# Altium schematic sheet DataDriven_sheet3_power_supply.SchDoc
size A3; SheetNumber: 3; SheetTotal: 4; SPICEModelCacheYQGNTXUW: <root> / <DocumentId>YQGNTXUW</DocumentId> / <CacheFrame Number="0"> / <Model Name="umk107bj105_a-t" Kind="CKT"> / <Text>* UMK107BJ105_A-T     SPICE MODEL  ( General Type ) / *-------------------------------------------------------------------------------------------------------- / * Model Generated by TAIYO YUDEN Corporation (http://www.ty-top.com) / * Version 1.0 / * TAIYO YUDEN Control No. 170508_130520 / * Copyright(c) 2012 TAIYO YUDEN CO.,LTD. All Rights Reserved. / *-------------------------------------------------------------------------------------------------------- / * / * Products Name : Multilayer Ceramic Capacitors / * / * Characteristics : / *     Capacitance : 1 uF , Rated Voltage : 50V , TCC : X5R / *     Case Size : 1.6 x 0.8 / 0.063 x 0.031 [mm/inch] , Thickness : 0.8 / 0.031 [mm/inch] / *     (Conditions: Temperature = 25 degC , DC Bias Current/Voltage = 0A / 0V) / * / * Frequency Range : 40Hz - 3GHz / * / * External Node Assignments : / * / *  1  o---| |---o  2 / * / *-------------------------------------------------------------------------------------------------------- / .SubCkt UMK107BJ105_A-T 1 2 / **************************** / C0 1 110 0.79929u / Cm 1 101 0.13681u / C1 101 102 0.26224u / Rc1 101 102 5.8806k / C2 102 103 0.057839u / Rc2 102 103 469.42 / C3 103 110 0.014568u / Rc3 103 110 14.853 / C2m 1 301 0.13283u / C21 301 302 1.2593u / Rc21 301 302 6.3079k / C22 302 303 1.1189u / Rc22 302 303 6.9405k / C23 303 304 1.1421u / Rc23 303 304 6.4848k / C24 304 305 0.36861u / Rc24 304 305 785 / C25 305 306 0.39327u / Rc25 305 306 637.41 / C26 306 307 0.27451u / Rc26 306 307 19.365 / C27 307 308 0.15295u / Rc27 307 308 23.239 / C28 308 309 0.17569u / Rc28 308 309 17.788 / C29 309 110 1420.6p / Rc29 309 110 1.9725 / Rp0 1 110 500Meg / L0 110 120 0.24088n / Lm 120 130 0.1369n / L1 120 121 0.1842n / RL1 121 130 0.29804 / L2 120 122 0.40657n / RL2 122 130 0.57395 / L3 120 123 0.85773n / RL3 123 130 0.82282 / CR 120 124 0.11463u / LR 124 125 0.25983n / RR 125 130 52.447m / CL 130 140 1.4637p / LL 130 140 0.23986n / RL 130 140 33.985 / Rs 140 2 6.8539m / **************************** / .ends UMK107BJ105_A-T</Text> / </Model> / </CacheFrame> / </root>
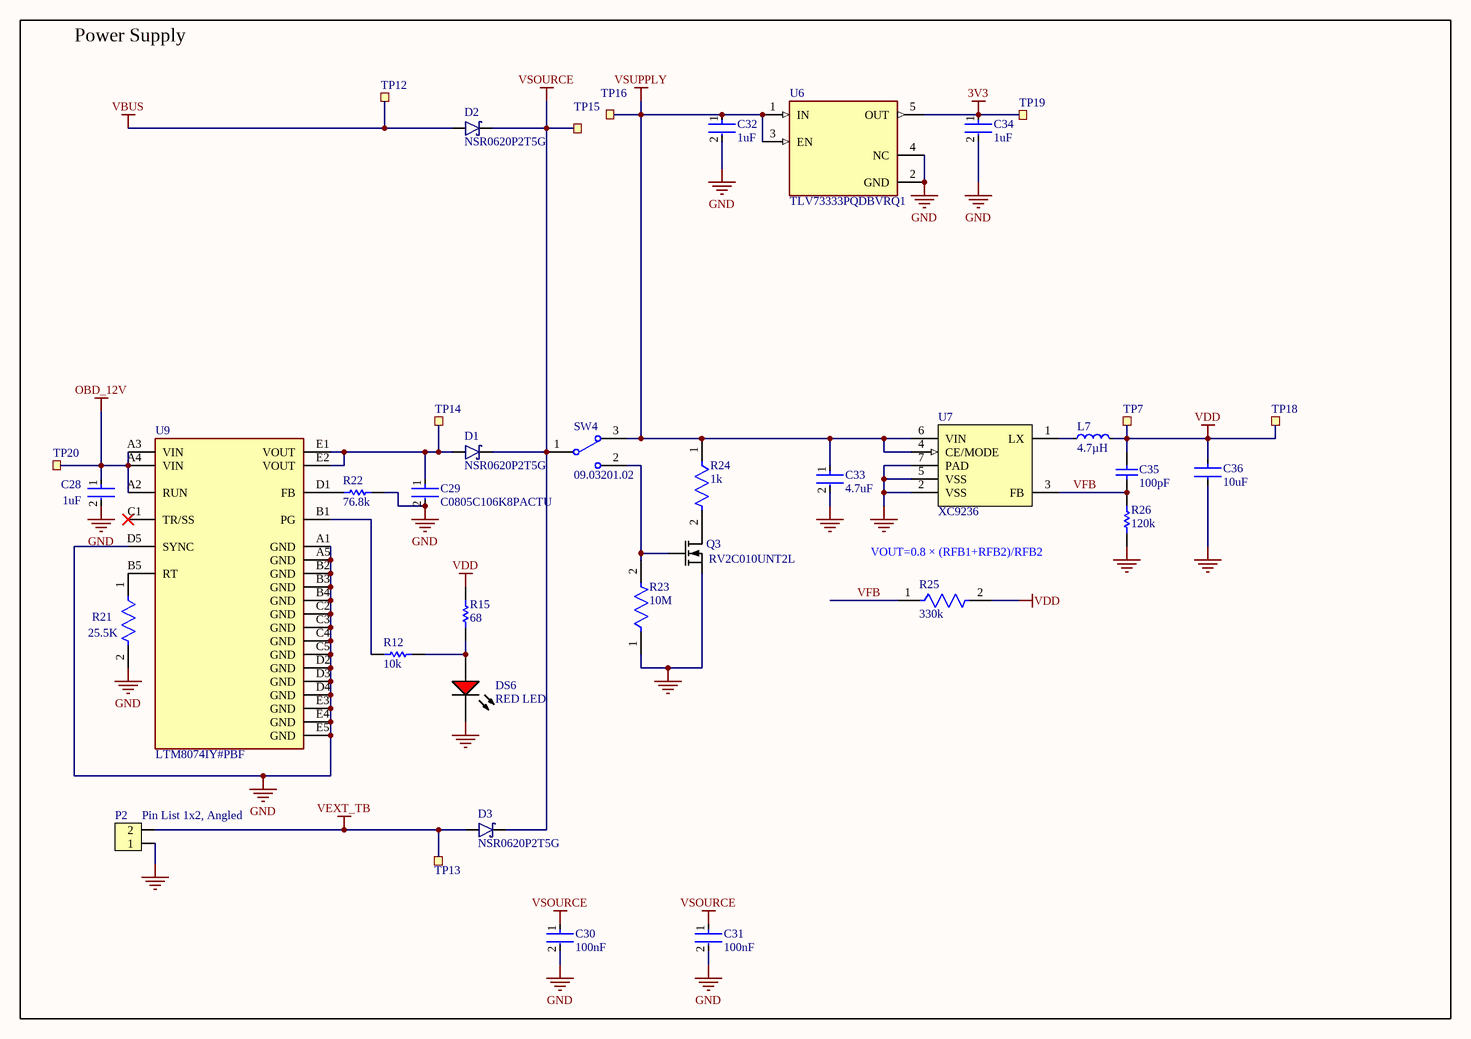
[diagram p0: DataDriven_sheet3_power_supply.SchDoc]

## Parts
C28  1uF  [FP-0603-L_1_6_0_1-W_0_8_0-IPC_A]
C29  C0805C106K8PACTU  [FP-C0805C-DG-MFG]
C30  100nF  [FP-CGA3E-0_3-0_1-IPC_A]
C31  100nF  [FP-CGA3E-0_3-0_1-IPC_A]
C32  1uF  [FP-GRT188-0_1-e0_2_0_5-IPC_B]
C33  4.7uF  [FP-GRM188-0_2-IPC_C]
C34  1uF  [FP-GRT188-0_1-e0_2_0_5-IPC_B]
C35  100pF  [CAPC1608X90X40ML10T20]
C36  10uF  [FP-CL10-IPC_C]
D1  NSR0620P2T5G  [SODFL100X40-2N]
D2  NSR0620P2T5G  [SODFL100X40-2N]
D3  NSR0620P2T5G  [SODFL100X40-2N]
DS6  RED LED  [VISH-TLMX1100_V]
L7  4.7µH  [TY-NR3015]
P2  Pin List 1x2, Angled  [LIST_ANG_1x2-SMD-2.54MM]
Q3  RV2C010UNT2L  [DFN65P100X40-3L]
R12  10k  [RESC1609X50X30NL8T20]
R15  68  [RESC1608X55X30ML15T15]
R21  25.5K  [FP-CRCW0603-e3-IPC_A]
R22  76.8k  [RESC1609X50X30ML10T20]
R23  10M  [FP-RMCF0603-IPC_A]
R24  1k  [FP-CRCW0603-e3-MFG]
R25  330k  [FP-CRCW0603-e3-IPC_A]
R26  120k  [RESC1609X55X30ML15T15]
SW4  09.03201.02  [EOZ-09.03201.02-3]
TP7  Ø1.5mm,SMD  [TP_SMD_D1.5mm]  (value not drawn)  (no BOM)
TP12  Ø1.5mm,SMD  [TP_SMD_D1.5mm]  (value not drawn)  (no BOM)
TP13  Ø1.5mm,SMD  [TP_SMD_D1.5mm]  (value not drawn)  (no BOM)
TP14  Ø1.5mm,SMD  [TP_SMD_D1.5mm]  (value not drawn)  (no BOM)
TP15  Ø1.5mm,SMD  [TP_SMD_D1.5mm]  (value not drawn)  (no BOM)
TP16  Ø1.5mm,SMD  [TP_SMD_D1.5mm]  (value not drawn)  (no BOM)
TP18  Ø1.5mm,SMD  [TP_SMD_D1.5mm]  (value not drawn)  (no BOM)
TP19  Ø1.5mm,SMD  [TP_SMD_D1.5mm]  (value not drawn)  (no BOM)
TP20  Ø1.5mm,SMD  [TP_SMD_D1.5mm]  (value not drawn)  (no BOM)
U6  TLV73333PQDBVRQ1  [FP-DBV0005A-MFG]
U7  XC9236  [USP-6C]
U9  LTM8074IY#PBF  [FP-BGA-25-05-08-1566-MFG]

## Nets
3V3: C34.1 TP19.1 U6.5(OUT)
GND: C28.2 C29.2 C30.2 C31.2 C32.2 C33.2 C34.2 C36.2 DS6.2(K) P2.1 Q3.2(S) R21.2 R22.2 R23.1 R26.1 U6.2(GND) U6.4(NC) U7.2(VSS) U7.5(VSS) U7.7(PAD) U9.A1(GND) U9.A5(GND) U9.B2(GND) U9.B3(GND) U9.B4(GND) U9.C2(GND) U9.C3(GND) U9.C4(GND) U9.C5(GND) U9.D2(GND) U9.D3(GND) U9.D4(GND) U9.D5(SYNC) U9.E3(GND) U9.E4(GND) U9.E5(GND)
OBD_12V: C28.1 TP20.1 U9.A2(RUN) U9.A3(VIN) U9.A4(VIN)
VBUS: D2.2(A) TP12.1
VDD: C35.2 C36.1 L7.2 R15.2 R25.2 TP7.1 TP18.1
VEXT_TB: D3.2(A) P2.2 TP13.1
VSOURCE: C30.1 C31.1 D1.1(C) D2.1(C) D3.1(C) SW4.1 TP15.1
VSUPPLY: C32.1 C33.1 R24.1 SW4.3 TP16.1 U6.1(IN) U6.3(EN) U7.4(CE/MODE) U7.6(VIN)
VFB: C35.1 R25.1 R26.2 U7.3(FB)
NetC29_1: C29.1 D1.2(A) TP14.1 U9.E1(VOUT) U9.E2(VOUT)
NetDS6_1: DS6.1(A) R12.2 R15.1
NetL7_1: L7.1 U7.1(LX)
NetQ3_1: Q3.1(G) R23.2 SW4.2
NetQ3_3: Q3.3(D) R24.2
NetR12_1: R12.1 U9.B1(PG)
NetR21_1: R21.1 U9.B5(RT)
NetR22_1: R22.1 U9.D1(FB)

Not connected (* = marked no-connect by the designer): U9 C1(TR/SS)*

## Notes on the sheet
- Power Supply
- VOUT=0.8 × (RFB1+RFB2)/RFB2

## Library data of the parts
C28 = CMP-2000-05447-3: 1 µF ±10% 50V Ceramic Capacitor X5R 0603 (1608 Metric); Manufacturer: Taiyo Yuden; Manufacturer Part Number: UMK107BJ105KA-T; Tolerance: 10%; Height: 0.8mm; Depth: 0.8mm; Number of Pins: 2; Length: 1.6mm; Thickness: 0.035inch; Voltage Rating: 50V; Contact Plating: Nickel; Radiation Hardening: No; Package Quantity: 1; Case/Package: 0603; Capacitance: 1uF; Halogen Free: Halogen Free; RoHS Compliant: Yes; Termination: SMD/SMT; Max Operating Temperature: 85°C; Min Operating Temperature: -55°C; Case Code (Metric): 1608; Construction: Flat; Voltage Rating (DC): 50V; Packaging: Tape and Reel; Series: M; Case Code (Imperial): 0603; Width: 0.031inch; Mount: Surface Mount; Dielectric: X5R; Part Number: UMK107BJ105KA-T
C29 = CMP-2007-03243-2: CAP CER 10UF 10V X5R 0805; Manufacturer: Kemet; 3DS Part Number: 220-00001; Tolerance: 10%; Temperature Coefficient: 15%; Material: Ceramic; Device Class L2: Capacitors; Device Class L1: Passive Components; ComponentLink2URL: https://content.kemet.com/datasheets/KEM_C1006_X5R_SMD.pdf; Height: 1.4mm; Lead Free: Yes; Manufacturer Part Number: C0805C106K8PACTU; Digikey Description: CAP CER 10UF 10V X5R 0805; Octopart: https://octopart.com/c0805c106k8pactu-kemet-98697; Capacitance: 10uF; Value: 10uF; Temperature Range Low: -55°C; Temperature: -55°C to +85°C; Automotive: No; Mouser Description: CAP CER 10UF 10V X5R 0805; Ipc Land Pattern Name: CAPC200125X125; Temperature Range High: +85°C; Voltage: 10V; RoHS: TRUE; Device Class L3: Ceramic Capacitors; ComponentLink2Description: Datasheet; Voltage Rating: 10V; Package: C0805C-DG; Temperature Characteristic: X5R; Category: Cap
C30 = CMP-2000-07546-2: Cap Ceramic 100nF 50V X7R 10% Pad SMD 0603 +125°C Automotive T/R; Manufacturer: TDK; Manufacturer Part Number: CGA3E2X7R1H104K080AA; Weight: 7.1E-05oz; Composition: Ceramic; Max Operating Temperature: 125°C; Termination: SMD/SMT; Dielectric: X7R; Length: 1.6mm; Package Quantity: 1; REACH SVHC: No SVHC; Lead Free: Lead Free; Case Code (Metric): 1608; Min Operating Temperature: -55°C; Packaging: Tape and Reel; Tolerance: 10%; Voltage Rating: 50V; Case Code (Imperial): 0603; Capacitance: 100nF; Case/Package: 0603; Voltage Rating (DC): 50V; Depth: 0.8mm; Radiation Hardening: No; Ratings: AEC-Q200; Mount: Surface Mount; Voltage: 50V; Thickness: 0.035inch; Width: 0.8mm; Height: 0.8mm; Part Number: CGA3E2X7R1H104K080AA
C31 = CMP-2000-07546-2: Cap Ceramic 100nF 50V X7R 10% Pad SMD 0603 +125°C Automotive T/R; Manufacturer: TDK; Manufacturer Part Number: CGA3E2X7R1H104K080AA; Part Number: GA3E2X7R1H104K080AA; Weight: 7.1E-05oz; Composition: Ceramic; Max Operating Temperature: 125°C; Termination: SMD/SMT; Dielectric: X7R; Length: 1.6mm; Package Quantity: 1; REACH SVHC: No SVHC; Lead Free: Lead Free; Case Code (Metric): 1608; Min Operating Temperature: -55°C; Packaging: Tape and Reel; Tolerance: 10%; Voltage Rating: 50V; Case Code (Imperial): 0603; Capacitance: 100nF; Case/Package: 0603; Voltage Rating (DC): 50V; Depth: 0.8mm; Radiation Hardening: No; Ratings: AEC-Q200; Mount: Surface Mount; Voltage: 50V; Thickness: 0.035inch; Width: 0.8mm; Height: 0.8mm
C32 C34 = CMP-06035-031856-1: Multi-Layer Ceramic Capacitor 1uF 50V X5R ±10% 0603 Paper T/R; Manufacturer: Murata; Manufacturer Part Number: GRT188R61H105KE13D; Voltage Rating (DC): 50V; Voltage Rating: 50V; Min Operating Temperature: -55°C; Case Code (Metric): 1608; Thickness: 0.035inch; Width: 0.031inch; Capacitance: 1uF; Tolerance: 10%; Max Operating Temperature: 85°C; Dielectric: X5R; Case Code (Imperial): 0603; Case/Package: 0603; Length: 0.063inch; Packaging: Tape and Reel; Mount: Surface Mount; Ratings: AEC-Q200; Part Number: GRT188R61H105KE13D
C33 = CMP-2006-02545-2: Chip Multilayer Ceramic Capacitors for General Purpose, 0603, 4.7uF, X5R, 15%, 10%, 35V; Manufacturer: Murata; Manufacturer Part Number: GRM188R6YA475KE15D; Lead Free: Lead Free; Max Operating Temperature: 85°C; Case Code (Imperial): 0603; Capacitance: 4.7uF; Width: 0.8mm; Thickness: 0.031inch; Case Code (Metric): 1608; Min Operating Temperature: -55°C; Voltage Rating (DC): 35V; Dielectric: X5R; Voltage: 35V; Packaging: Tape and Reel; Resistor Type: Ceramic; Weight: 0.000222oz; Mount: Surface Mount; Material: Ceramic; Depth: 0.8mm; Tolerance: 10%; REACH SVHC: No SVHC; Case/Package: 0603; Voltage Rating: 35V; Package Quantity: 4000; Height: 0.8mm; Length: 1.6mm; Termination: SMD/SMT; Part Number: GRM188R6YA475KE15D
C35 = CMP-2100-03594-1: Chip Capacitor, 100 pF, +/- 5%, 50 V, -55 to 125 degC, 0603 (1608 Metric), RoHS, Tape and Reel; Manufacturer: Yageo; Manufacturer Part Number: CC0603JRNPO9BN101; Voltage Rating (DC): 50V; Dielectric: C0G; Temperature Coefficient: 30ppm/degC; Insulation Resistance: 100GR; Datasheet Version: Rev. 14, 07/2016; Manufacturer URL: http://www.yageo.com/; Packaging: TapeandReel; Mount: SurfaceMount; RoHSCompliant: True; Package Reference: 0603; Tolerance: 5%; Max Operating Temperature: 125degC; Case Code (Imperial): 0603; Capacitance: 100pF; Number of Pins: 2; Width: 0.8mm; Case Code (Metric): 1608; Voltage: 50V; REACH SVHC: Unknown; Package Description: 2-Pin Surface Mount Device, Body 1.6 x 0.8 mm; Composition: Ceramic; Lead Free: LeadFree; Min Operating Temperature: -55degC; Radiation Hardening: No; Depth: 0.8mm; Thickness: 0.035inch; Datasheet URL: http://www.yageo.com/documents/recent/UPY-GP_NP0_16V-to-50V_14.pdf; Termination: SMD/SMT; Package Quantity: 1; Length: 1.6mm; Voltage Rating: 50V; Height: 0.8mm; Case/Package: 0603; Part Number: CC0603JRNPO9BN101; Resistance: CC0603JRNPO9BN101
C36 = CMP-13271-004224-1: Cap Ceramic 10uF 25V X5R ±20% Pad SMD 0603 +85°C T/R; Manufacturer: Samsung; Manufacturer Part Number: CL10A106MA8NRNC; Width: 0.031inch; Voltage Rating: 25V; Length: 0.063inch; Case Code (Metric): 1608; Dielectric: X5R; Termination: Wraparound; Capacitance: 10uF; Lead Free: Lead Free; Mount: Surface Mount; Package Quantity: 1; Case Code (Imperial): 0603; Thickness: 0.035inch; Packaging: Tape and Reel; Contact Plating: Tin; Min Operating Temperature: -55°C; Tolerance: 20%; Max Operating Temperature: 85°C; Case/Package: 0603; Part Number: CL10A106MA8NRNC
D1-D3 = NSR0620P2T5G: 20V schottky barrier diode, Vf 350 mV @ 100 mA, Ir 2.0 µA @ 10 V, If 500 mA; Manufacturer: ON Semiconductor; Part number IPS: 00000009952; Note: N.A.; Artikkelnr Noca: 10029169; Pad Count: 2; Part Number: NSR0620P2T5G; Manufacturer Part Number: NSR0620P2T5G; LatestRevisionDate: 2016-07-07; Published: 2016-07-07; Value: NSR0620P2T5G; Footprint Doc: SOD-923; ComponentLink1URL: N.A.; ComponentLink1Description: Datasheet; ComponentLink2URL: N.A.; ComponentLink2Description: Supplier link; HelpURL: http://www.onsemi.com/pub_link/Collateral/NSR0620P2-D.PDF; Supplier 1: Digi-Key; Supplier Part Number 1: NSR0620P2T5GOSCT-ND; Supplier 2: N.A.; Supplier Part Number 2: N.A.; PartId: 101300131; Component Class: Semiconductors; Author: rsk; Part number Norautron: N.A.
DS6 = CMP-1666-00027-1: LED, RED, 2.1 V, -40 to 100 degC, 2-Pin SMD (0603), RoHS, Tape and Reel; Manufacturer: Vishay; Manufacturer Part Number: TLMS1100-GS08; Type (Capacitors): C0G; Resistance: 100000000000 Ohm; Capacitance: 12 pF; Voltage Rating: 50 V; Tolerance: 5%; Min Operating Temperature: -55degC; REACH SVHC: No SVHC; ComponentLink2Description: Datasheet; ComponentLink1URL: http://www.vishay.com/; Width: 0.8 mm; Package Quantity: 4000; PackageReference: TLMX1100; ComponentLink2URL: http://www.vishay.com/docs/83173/tlmb1100.pdf; Case/Package: 0603; Case Code (Metric): 1608; Packaging: Tape and Reel; Pins: 2; ComponentLink1Description: Manufacturer URL; Max Operating Temperature: 125degC; Height: 0.8 mm; Length: 1.6 mm; Mount: Surface Mount; PackageDescription: 2-Pin Surface Mount Device, Body 1.6 x 0.8 mm; DatasheetVersion: Rev. 2.7, 03/2016; Case Code (Imperial): 0603; Voltage Rating (DC): 50 V; RoHSCompliant: True; Radiation Hardening: No; Part Number: TLMS1100-GS08
L7 = NR3015-4µ7-1.04A-144mOhm: Ferrite Inductor, Shielded, 1,04A, 144mOhm; Manufacturer: Taiyo Yuden; Manufacturer Part Number: NR3015T4R7M; Part number IPS: 00000009960; Note: N.A.; Artikkelnr Noca: 33029551; Pad Count: 2; Part Number: NR3015-4µ7-1.04A-144mOhm; Footprint Doc: 1212; LatestRevisionDate: 2014-01-22; Published: 2014-01-22; Value: 4.7µH; ComponentLink1URL: N.A.; ComponentLink1Description: Datasheet; ComponentLink2URL: N.A.; ComponentLink2Description: Supplier link; HelpURL: http://www.yuden.co.jp/ut/product/category/inductor/NR3015T4R7M.pdf; PartId: 100300145; Component Class: Inductors; Author: rsk; Part number Norautron: N.A.; Supplier 1: Mouser; Supplier Part Number 1: 81-LQM18FN4R7M00D
P2 = Pin List Ang 1x2 SMD, 2.54mm: Pin List 1x2, 2.54mm (100mil), Right Angled, SMD; Manufacturer: W-CON; Manufacturer Part Number: 1125B-1102S0Z135R2; Part number IPS: 00000009972; Note: N.A.; Artikkelnr Noca: 55010023; Pad Count: 2; Part Number: Pin List Ang 1x2 SMD, 2.54mm; Footprint Doc: LIST_ANG_1x2-SMD-2.54MM; LatestRevisionDate: 2016-05-26; Published: 2016-01-22; Value: Pin List 1x2, Angled; ComponentLink1URL: N.A.; ComponentLink1Description: Datasheet; ComponentLink2URL: N.A.; ComponentLink2Description: Supplier link; HelpURL: \\hizz\pro\app9717\Datasheet\connectors\W-CON\1125B-11XXXXZXXXXX.pdf; Supplier 1: Cabcon; Supplier Part Number 1: 1125B-1102S0Z135R2; Supplier 2: Samtec; Supplier Part Number 2: TSM-102-01-L-SH-A; PartId: 100500354; Component Class: Connectors; Author: rsk; Part number Norautron: N.A.
Q3 = RV2C010UNT2L: N-Channel MOSFET, 20V, 1A, 470mOhm, 400mW; Manufacturer: Rohm Semiconductor; Part number IPS: 00000009976; Note: N.A.; Artikkelnr Noca: 35010020; Pad Count: 3; Part Number: RV2C010UNT2L; Manufacturer Part Number: RV2C010UNT2L; Footprint Doc: DFN-3; LatestRevisionDate: 2016-08-09; Published: 2016-08-09; Value: RV2C010UNT2L; ComponentLink1URL: N.A.; ComponentLink1Description: Datasheet; ComponentLink2URL: N.A.; ComponentLink2Description: Supplier link; HelpURL: http://rohmfs.rohm.com/en/products/databook/datasheet/discrete/transistor/mosfet/rv2c010unt2l-e.pdf; Supplier 1: Digi-Key; Supplier Part Number 1: RV2C010UNT2LCT-ND; Supplier 2: Mouser; Supplier Part Number 2: 755-RV2C010UNT2L; PartId: 101300132; Component Class: Semiconductors; Author: rsk; Part number Norautron: N.A.
R12 = CMP-1666-00005-4: Chip Resistor, 10 KOhm, +/- 1%, 100 mW, -55 to 155 degC, 0603 (1608 Metric), RoHS, Tape and Reel; Manufacturer: Vishay Semiconductor; Manufacturer Part Number: Vishay; Part Number: CRCW060310K0FKEA; Voltage Rating: 75 V; Max Operating Temperature: 155 degC; PackageDescription: 2-Pin Surface Mount Device, Body 1.575 x 0.85 mm; ComponentLink1Description: Manufacturer URL; RoHSCompliant: true; PackageReference: 0603; REACH SVHC: Unknown; Length: 1.55 mm; DatasheetVersion: 06/2012; Packaging: Tape and Reel; Min Operating Temperature: -55 degC; Mounting Technology: Surface Mount; ComponentLink2URL: https://datasheet.ciiva.com/11809/0900766b80d98afc-11809037.pdf; Height: 0.45 mm; ComponentLink2Description: Datasheet; Package Quantity: 5000; ComponentLink1URL: http://www.vishay.com/; Resistance: CRCW060310K0FKEA
R15 = CMP-2000-00620-1: 68 Ohms ±1% 0.1W, 1/10W Chip Resistor 0603 (1608 Metric) Automotive AEC-Q200 Thick Film; Manufacturer: Panasonic; Part Number: ERJ3EKF68R0V; Manufacturer Part Number: ERJ-3EKF68R0V
R21 = CMP-2000-03129-2: RES Thick Film, 25.5kΩ, 1%, 0.1W, 100ppm/°C, 0603; Manufacturer: Vishay; Manufacturer Part Number: CRCW060325K5FKEA; Power Rating: 100mW; Voltage Rating (DC): 75V; Resistance: 25.5kR; Termination: SMD/SMT; Temperature Coefficient: 100ppm/°C; Lead Free: Lead Free; Features: Automotive AEC-Q200; Case/Package: 0603; Width: 0.033inch; Min Operating Temperature: -55°C; Number of Pins: 2; Package Quantity: 10; Case Code (Metric): 1608; Military Standard: Not; Case Code (Imperial): 0603; Length: 1.55mm; Composition: Thick Film; Max Operating Temperature: 155°C; Height: 0.45mm; Number of Terminations: 2; Packaging: Tape and Reel; Radiation Hardening: No; Depth: 0.85mm; Tolerance: 1%; Contact Plating: Tin; Working Voltage: 75V; Weight: 7.1E-05oz; Max Power Dissipation: 100mW; Voltage Rating: 75V; Part Number: CRCW060325K5FKEA
R22 = CMP-1012-00723-2: 76.8 kOhms ±1% 0.1W, 1/10W Chip Resistor 0603 (1608 Metric) Automotive AEC-Q200 Thick Film; Part Number: CRCW060376K8FKEA; Manufacturer: Vishay Dale; Manufacturer Part Number: CRCW060376K8FKEA
R23 = CMP-26527-003301-1: 10MΩ ±5% 0.1W 0603 Thick Film Chip Resistor AEC-Q200 compliant; Manufacturer: Stackpole Electronics; Manufacturer Part Number: RMCF0603JT10M0; Resistance: 10MR; Temperature Coefficient: 200ppm/°C; Power Rating: 100mW; Features: Automotive AEC-Q200; Height: 0.022inch; Lead Free: Lead Free; Military Standard: Not; Mount: Surface Mount; Width: 0.031inch; RoHS Compliant: Yes; Contact Plating: Tin; Case/Package: 0603; Construction: Rectangular; Length: 0.061inch; Depth: 0.8mm; Tolerance: 5%; Resistor Type: Thick Film; Case Code (Metric): 1608; Packaging: Tape and Reel; Case Code (Imperial): 0603; Number of Terminations: 2; Size Code: 0603; Radiation Hardening: No; Max Operating Temperature: 155°C; Series: RMCF; Max Power Dissipation: 100mW; Min Operating Temperature: -55°C; Part Number: RMCF0603JT10M0
R24 = CMP-1666-00003-5: RES Thick Film, 1kΩ, 1%, 0.1W, 100ppm/°C, 0603; Manufacturer: Vishay Dale; Manufacturer Part Number: CRCW06031K00FKEA; Max Power Dissipation: 100mW; Voltage Rating: 75V; Resistance: 1kR; Max Operating Temperature: 155°C; Number of Pins: 2; Case Code (Imperial): 0603; Width: 0.033inch; Power Rating: 100mW; Number of Terminations: 2; Package Quantity: 10; Weight: 7.1E-05oz; Tolerance: 1%; Temperature Coefficient: 100ppm/°C; Military Standard: Not; Mount: Surface Mount; Voltage Rating (DC): 75V; Depth: 0.85mm; Composition: Thick Film; Radiation Hardening: No; Termination: SMD/SMT; Length: 1.55mm; Case Code (Metric): 1608; Contact Plating: Tin; Min Operating Temperature: -55°C; Packaging: Tape and Reel; Height: 0.45mm; Lead Free: Lead Free; Case/Package: 0603; Features: Automotive AEC-Q200; Part Number: CRCW06031K00FKEA
R25 = CMP-2000-03237-2: RES Thick Film, 330kΩ, 1%, 0.1W, 100ppm/°C, 0603; Manufacturer: Vishay; Manufacturer Part Number: CRCW0603330KFKEA; Working Voltage: 75V; Resistance: 330kR; Power Rating: 100mW; Weight: 7.1E-05oz; Length: 1.55mm; Width: 0.85mm; Voltage Rating: 75V; Features: Automotive AEC-Q200; Min Operating Temperature: -55°C; Radiation Hardening: No; Lead Free: Lead Free; Mount: Surface Mount; Height: 0.45mm; Contact Plating: Tin; Case Code (Imperial): 0603; Tolerance: 1%; Max Operating Temperature: 155°C; Termination: SMD/SMT; Number of Terminations: 2; Package Quantity: 10; Voltage Rating (DC): 75V; Max Power Dissipation: 100mW; Case Code (Metric): 1608; Case/Package: 0603; Packaging: Tape and Reel; Temperature Coefficient: 100ppm/°C; Military Standard: Not; Composition: Thick Film; Number of Pins: 2; Depth: 0.85mm; Part Number: CRCW0603330KFKEA
R26 = CMP-2000-00216-2: Chip Resistor, 120 KOhm, +/- 1%, 0.1 W, -55 to 155 degC, 0603 (1608 Metric), RoHS, Tape and Reel; Manufacturer: Panasonic; Manufacturer Part Number: ERJ-3EKF1203V; Voltage Rating (DC): 75V; Temperature Coefficient: 100ppm/degC; Max Power Dissipation: 100mW; Depth: 0.8mm; Min Operating Temperature: -55degC; Number of Terminations: 2; Case Code (Metric): 1608; Datasheet Version: 42095.0; Tolerance: 1%; Radiation Hardening: No; REACH SVHC: NoSVHC; Package Description: 2-Pin Surface Mount Device, Body 1.6 x 0.85 mm; Package URL: http://www.st.com/st-web-ui/static/active/en/resource/technical/document/datasheet/CD00001320.pdf; Number of Pins: 2; Height: 0.022inch; Voltage Rating: 75V; Datasheet URL: https://industrial.panasonic.com/cdbs/www-data/pdf/RDA0000/AOA0000C283.pdf; Composition: ThickFilm; Length: 1.6mm; Width: 0.8mm; Packaging: TapeandReel; Package Reference: 0603; Package Quantity: 1; Manufacturer URL: http://www.panasonic.com/; Mount: SurfaceMount; RoHSCompliant: True; Military Standard: Not; Contact Plating: Tin; Case/Package: 0603; Max Operating Temperature: 155degC; Resistance: 120KOhm; Power Rating: 100mW; Case Code (Imperial): 0603; Termination: SMD/SMT; Lead Free: LeadFree; Part Number: ERJ-3EKF1203V
SW4 = CMP-2000-05100-1: PCB Switch, SPDT, 12 V, 500 mA, 6 W, -40 to 85 degC, 3-Pin THD, RoHS, Tape and Reel; Manufacturer: EOZ; Part Number: EAO 09.03201.02; Number of Positions: 2; Contact Current Rating: 500mA@24V; Mechanical Life: 10000Operations; Actuator Type: Slide; Contact Configuration: SPST; Package Style: SIP; Manufacturer URL: http://eozonline.com/; Mounting Type: ThroughHole; Operating Temperature Range: -40→+85degC; Datasheet Version: Apr-10; Datasheet URL: http://www.farnell.com/datasheets/1683364.pdf; Maximum Operating Temperature: +85degC; Minimum Operating Temperature: -40degC; Contact Material: GoldoverNickelPlated; Manufacturer Part Number: EAO 09.03201.02
TP7 TP12-TP16 TP18-TP20 = TP_SMD_Ø1.5MM: 1.5mm circular SMD testpad; Manufacturer: Nordic Semiconductor; Manufacturer Part Number: NRF9160-SICA-B1A-R; Note: N.A.; Pad Count: 1; Part Number: TP_SMD_Ø1.5MM; ComponentLink1URL: N.A.; ComponentLink1Description: Datasheet; ComponentLink2URL: N.A.; ComponentLink2Description: Supplier link; HelpURL: N.A.; Footprint Doc: TP_SMD_Ø1.5mm; LatestRevisionDate: 2021-03-05; Published: 2016-06-02; Value: Ø1.5mm,SMD; Artikkelnr Noca: N.A.; Part number IPS: N.A.; Supplier 1: N.A.; Supplier Part Number 1: N.A.; Supplier 2: N.A.; Supplier Part Number 2: N.A.; PartId: 100500477; Component Class: Connectors; Author: rsk; Part number Norautron: N.A.
U6 = CMP-04917-000347-1: IC REG LINEAR 3.3V 300MA SOT23-5; Manufacturer: Texas Instruments; RoHS Compliant: Yes; Manufacturer Part Number: TLV73333PQDBVRQ1; Part Number: TLV73333PQDBVRQ1
U7 = XC9236F08CER-G: 600mA Driver Transistor Built-In, Synchronous Step-Down DC/DC Converters; Manufacturer: Torex Semiconductor; Part number IPS: 00000009989; Note: N.A.; Pad Count: 6; Part Number: XC9236F08CER-G; Manufacturer Part Number: XC9236F08CER-G; Footprint Doc: USP-6C; LatestRevisionDate: 2017-11-15; Published: 2016-08-08; Value: XC9236; Artikkelnr Noca: N.A.; ComponentLink1URL: N.A.; ComponentLink1Description: Datasheet; ComponentLink2URL: N.A.; ComponentLink2Description: Supplier link; HelpURL: http://www.torexsemi.com/products/dcdc_converters/data/XC9235~37.pdf; Supplier 1: Mouser; Supplier Part Number 1: 865-XC9236F08CER-G; Supplier 2: N.A.; Supplier Part Number 2: N.A.; PartId: 101900206; Component Class: Misc_ICs; Author: rsk; Part number Norautron: N.A.
U9 = CMP-09139-000733-1: IC REG BUCK ADJ 1.2A 25BGA; Manufacturer: Analog Devices Inc.; Manufacturer Part Number: LTM8074IY#PBF